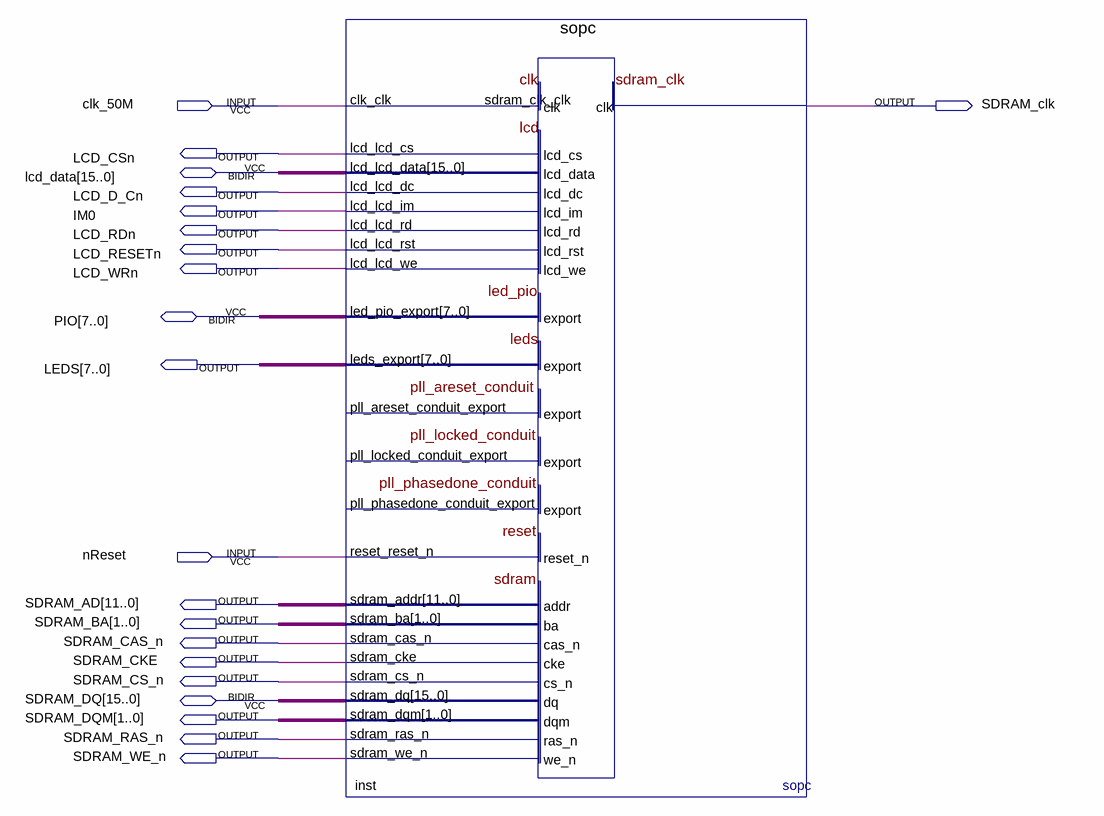
[diagram p0: schematic sheet]
// Quartus schematic lab4GetStarted.bdf as structural Verilog: 1 symbols, 21 pins
module lab4GetStarted (
  input  clk_50M,
  input  nReset,
  inout  [15:0] lcd_data,
  inout  [7:0] PIO,
  inout  [15:0] SDRAM_DQ,
  output SDRAM_clk,
  output LCD_CSn,
  output LCD_D_Cn,
  output IM0,
  output LCD_RDn,
  output LCD_RESETn,
  output LCD_WRn,
  output [7:0] LEDS,
  output [11:0] SDRAM_AD,
  output [1:0] SDRAM_BA,
  output SDRAM_CAS_n,
  output SDRAM_CKE,
  output SDRAM_CS_n,
  output [1:0] SDRAM_DQM,
  output SDRAM_RAS_n,
  output SDRAM_WE_n
);

  sopc inst (
    .clk_clk(clk_50M), .reset_reset_n(nReset), .lcd_lcd_cs(LCD_CSn), .lcd_lcd_dc(LCD_D_Cn), .lcd_lcd_im(IM0),
    .lcd_lcd_rd(LCD_RDn), .lcd_lcd_rst(LCD_RESETn), .lcd_lcd_we(LCD_WRn), .leds_export(LEDS),
    .sdram_addr(SDRAM_AD), .sdram_ba(SDRAM_BA), .sdram_cas_n(SDRAM_CAS_n), .sdram_cke(SDRAM_CKE),
    .sdram_cs_n(SDRAM_CS_n), .sdram_dqm(SDRAM_DQM), .sdram_ras_n(SDRAM_RAS_n), .sdram_we_n(SDRAM_WE_n),
    .sdram_clk_clk(SDRAM_clk), .lcd_lcd_data(lcd_data), .led_pio_export(PIO), .sdram_dq(SDRAM_DQ));  // open: pll_areset_conduit_export, pll_locked_conduit_export, pll_phasedone_conduit_export
endmodule
